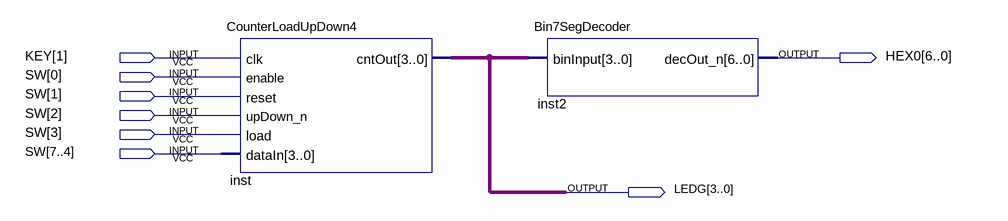
[diagram p0: schematic sheet]
// Quartus schematic Counter_Demo.bdf as structural Verilog: 2 symbols, 8 pins
module Counter_Demo (
  input  [1:1] KEY,
  input  [7:0] SW,
  output [6:0] HEX0,
  output [3:0] LEDG
);

  CounterLoadUpDown4 inst (
    .clk(KEY[1]), .enable(SW[0]), .reset(SW[1]), .upDown_n(SW[2]), .load(SW[3]), .dataIn(SW[7:4]),
    .cntOut(LEDG));
  Bin7SegDecoder inst2 (.binInput(LEDG), .decOut_n(HEX0));
endmodule
